# EAGLE design POEREG (EAGLE 9.6.2)
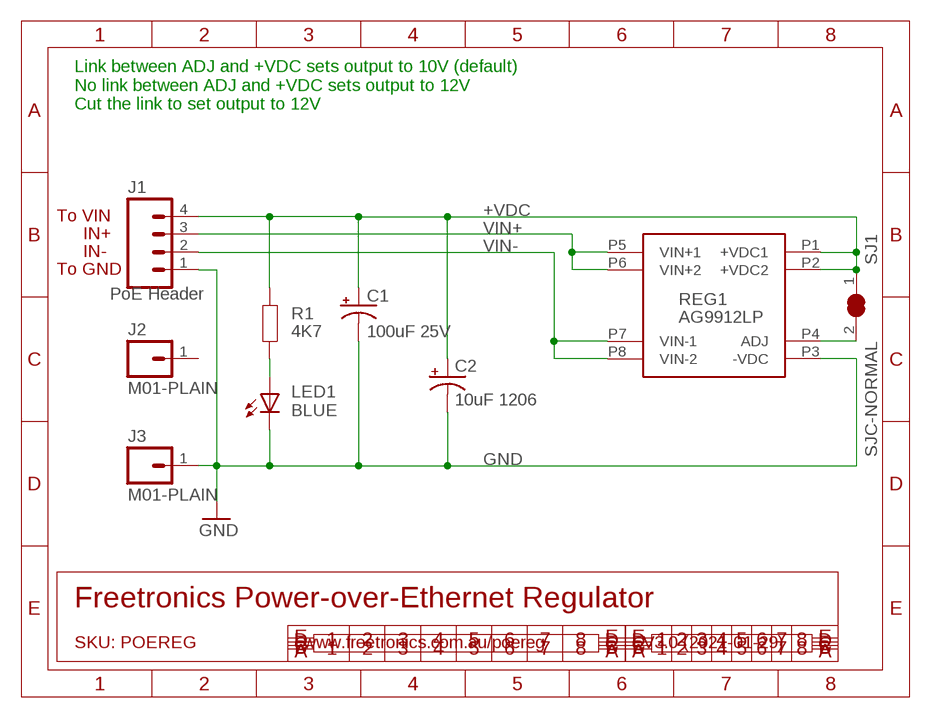
[diagram p0: schematic, sheet 1]

## Parts
C1  100uF 25V  CAP_POLD  [PANASONIC_D]
C2  10uF 1206  CAP_POL1206  [EIA3216]
J1  PoE Header  M04-PLAIN  [1X04]
J2  M01-PLAIN  [1X01]
J3  M01-PLAIN  [1X01]
LED1  BLUE  LED0603  [LED-0603]
R1  4K7  RESISTOR0603  [R0603]
REG1  AG9912LP  AG9900-LP  [AG9900LP]
SJ1  SJC-NORMAL  [SJC]

## Nets
+VDC: C1.+ C2.A(+) J1.4 R1.1 REG1.P1(+VDC1) REG1.P2(+VDC2) SJ1.1
GND: C1.- C2.C(-) J1.1 J3.1 LED1.C REG1.P3(-VDC)
N$1: REG1.P4(ADJ) SJ1.2
N$131: LED1.A R1.2
VIN+: J1.3 REG1.P5(VIN+1) REG1.P6(VIN+2)
VIN-: J1.2 REG1.P7(VIN-1) REG1.P8(VIN-2)
Unconnected: J2.1

## Notes on the sheet
- Link between ADJ and +VDC sets output to 10V (default)
  No link between ADJ and +VDC sets output to 12V
  Cut the link to set output to 12V
- To VIN
- IN+
- IN-
- To GND
- Freetronics Power-over-Ethernet Regulator
- SKU: POEREG | www.freetronics.com.au/poereg | V3.0 (2021-01-29)

## Library data of the parts
C1 C2 = SuperHouse-DiscreteSemi:CAP_POL: Capacitor Polarized These are standard SMD and PTH capacitors. Normally 10uF, 47uF, and 100uF in electrolytic and tantalum varieties. Always verify the external diameter of the through hole cap, it varies with capacity, voltage, and manufacturer. The EIA devices should be standard.
J1 = SuperHouse-Connectors:M04: 4-way header Standard 1x4 header, and screw terminal variations
J2 J3 = SuperHouse-Connectors:M01: 1-way header Standard 1x1 header
LED1 = SuperHouse-LEDs:LED: LEDs in various sizes including 5mm and 3mm PTH, and 0402, 0603, 0805, etc SMT
R1 = SuperHouse-DiscreteSemi:RESISTOR: Resistors in both surface-mount and through-hole versions.
REG1 = SuperHouse-Regulators:AG9900: Silvertel Power-over-Ethernet regulator module, 802.3af, fully isolated
SJ1 = SuperHouse-Jumpers:SJC: Solder jumper. Normally closed: does not need solder to close. Can be opened by cutting the track.

## Board
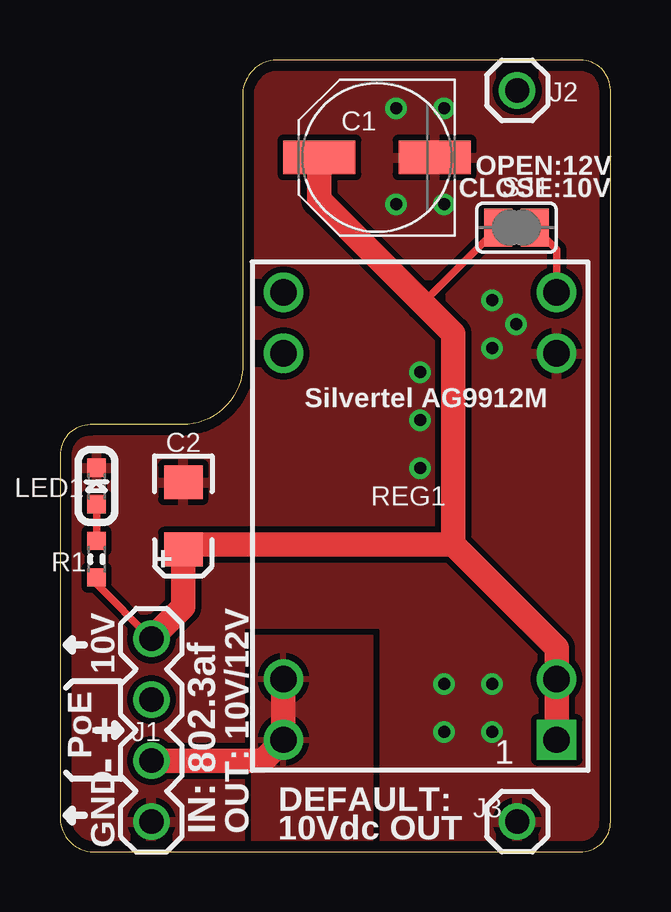
[diagram p1: board, top side]
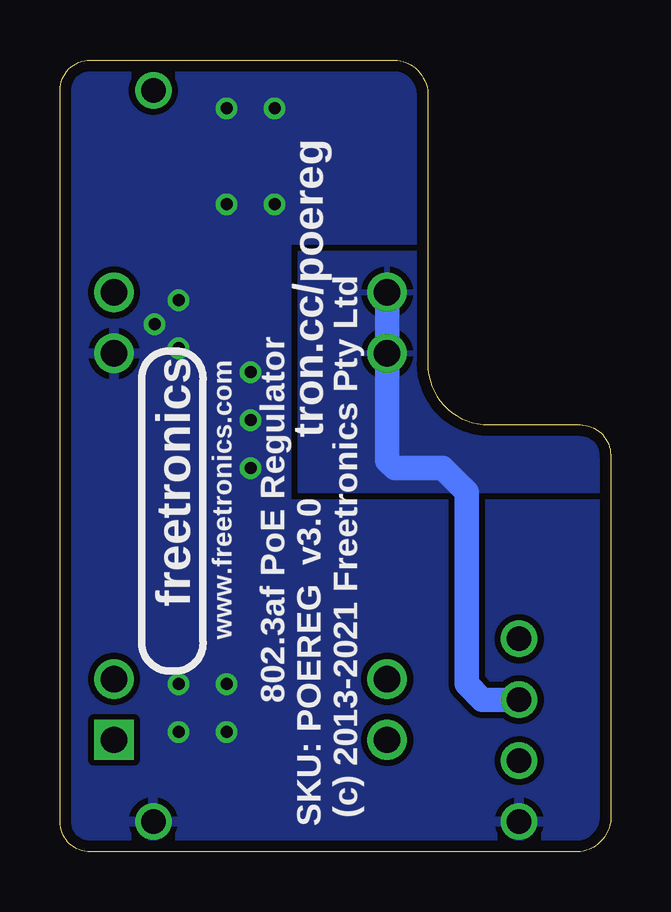
[diagram p2: board, bottom side, seen from below]

Size 22.94 x 33.02 mm. Coordinates in mm from the lower left corner, seen from the top.
Outline: 0,1.27 arc74 1.27,0 21.67,0 arc90 22.94,1.27 22.94,31.75 arc90 21.67,33.02 8.89,33.02 arc74 7.62,31.75 7.62,20.35 arc-90 5.08,17.81 1.27,17.81 arc90 0,16.54 0,1.27
Copper layers (1*16): Top 0.035mm / dielectric 1.5mm / Bottom 0.035mm
Design rules "default *": minimum track width 10mil, minimum drill 18mil, track to track 10mil, track to pad 10mil, pad to pad 10mil, via to via 10mil, smd to smd 8mil, copper to edge 18mil, drill to drill 8mil, minimum pad ring 10mil, minimum via ring 8mil, stop-mask expansion 4mil, vias tented up to drill 25mil, thermal gap 10mil

### Footprints (pad centres in the part's own frame; a part is rotated, then mirrored left to right if it is on the bottom)
PANASONIC_D = smd 3 x 1.4: + 2.4,0; - -2.4,0
EIA3216 = smd 1.4 x 1.6: A 1.4,0; C -1.4,0
1X04 = drill 1.016: 1 -3.81,0; 2 -1.27,0; 3 1.27,0; 4 3.81,0
1X01 = drill 1.016: 1 0,0
LED-0603 = smd 0.762 x 0.762: A -0.762,0; C 0.762,0
R0603 = smd 0.762 x 0.762: 1 -0.762,0; 2 0.762,0
AG9900LP = drill 1.1 square: P1 -5.69,9.325 | drill 1.1: P2 -5.69,6.785; P3 -5.69,-6.785; P4 -5.69,-9.325; P5 5.69,-9.325; P6 5.69,-6.785; P7 5.69,6.785; P8 5.69,9.325
SJC = smd 1.168 x 1.6: 1 -0.762,0; 2 0.762,0

### Placement (x,y rotation side)
C1  13.21,28.96 180 top
C2  5.14,14.01 270 top
J1  3.81,5.08 90 top
J2  19.05,31.75 0 top
J3  19.05,1.27 0 top
LED1  1.52,15.26 90 top
R1  1.52,12.21 90 top
REG1  15,14 180 top
SJ1  19.02,26.03 0 top

### Tracks (layer width: path | path; a pad name or v marks a point on that pad's centre or on a via)
+VDC
  Top 0.305: SJ1.1 15.11,22.89 | J1.4 1.52,11.18 R1.1
  Top 1.016: REG1.P1 REG1.P2 20.69,8.52 16.39,12.82 | C1.+ 10.81,27.19 15.11,22.89 16.39,21.61 16.39,12.82 | J1.4 5.14,10.22 C2.A 5.35,12.82 16.39,12.82
GND  (via drill 0.5)
  other vias: 16,7 16,5 18,5 18,7 18,23 18,21 15,16 15,20 19,22 16,27 16,31 15,18 14,27 14,31
  pour Top (rank 2): 1.27,0 arc-90 0,1.27 0,16.54 arc-90 1.27,17.81 5.08,17.81 arc90 7.62,20.35 7.62,31.75 arc-90 8.89,33.02 21.67,33.02 arc-90 22.94,31.75 22.94,1.27 arc-90 21.67,0
  pour Bottom (rank 2): 0,1.27 0,16.54 arc-90 1.27,17.81 5.08,17.81 arc90 7.62,20.35 7.62,31.75 arc-90 8.89,33.02 21.67,33.02 arc-90 22.94,31.75 22.94,1.27 arc-90 21.67,0 1.27,0 arc-90
N$1
  Top 0.305: SJ1.2 20.69,25.12 REG1.P4
N$131
  Top 0.305: LED1.A R1.2
VIN+
  Bottom 1.016: REG1.P5 REG1.P6 9.31,16.31 9,16 7,16 6,15 6,7 5.35,6.35 J1.3
  pour Bottom: 0,25 13,25 13,15 0,15
VIN-
  Top 1.016: REG1.P7 REG1.P8 8.45,3.81 J1.2
  pour Top: 8,9 13,9 13,0 8,0

### Text on the board
tPlace: OPEN:12V | CLOSE:10V | Silvertel AG9912M | + | 10V | PoE | - + | DEFAULT: | IN: 802.3af | OUT: 10V/12V | 10Vdc OUT | GND
bPlace: www.freetronics.com | freetronics | tron.cc/poereg | 802.3af PoE Regulator | (c) 2013-2021 Freetronics Pty Ltd | SKU: POEREG v3.0
tDocu: K | A | +